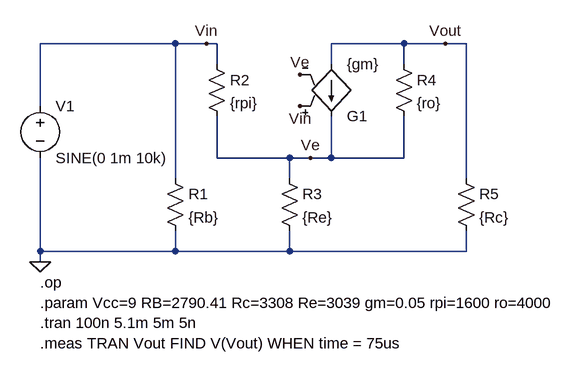
[diagram p0: schematic CE-degen-ro-gain-ac.asc]
CE-degen-ro-gain-ac.asc, the LTspice schematic file:
Version 4
SHEET 1 1048 680
WIRE 192 144 -16 144
WIRE 240 144 192 144
WIRE 256 144 240 144
WIRE 544 144 432 144
WIRE 608 144 544 144
WIRE 640 144 608 144
WIRE 256 176 256 144
WIRE 432 176 432 144
WIRE 544 176 544 144
WIRE -16 240 -16 144
WIRE 256 320 256 256
WIRE 368 320 256 320
WIRE 400 320 368 320
WIRE 432 320 432 256
WIRE 432 320 400 320
WIRE 544 320 544 256
WIRE 544 320 432 320
WIRE 192 352 192 144
WIRE 368 352 368 320
WIRE 640 352 640 144
WIRE -16 464 -16 320
WIRE 192 464 192 432
WIRE 192 464 -16 464
WIRE 368 464 368 432
WIRE 368 464 192 464
WIRE 640 464 640 432
WIRE 640 464 368 464
WIRE -16 480 -16 464
FLAG -16 480 0
FLAG 608 144 Vout
FLAG 400 320 Ve
FLAG 240 144 Vin
FLAG 384 240 Vin
FLAG 384 192 Ve
SYMBOL res 176 336 R0
SYMATTR InstName R1
SYMATTR Value {Rb}
SYMBOL res 240 160 R0
SYMATTR InstName R2
SYMATTR Value {rpi}
SYMBOL res 352 336 R0
SYMATTR InstName R3
SYMATTR Value {Re}
SYMBOL res 528 160 R0
SYMATTR InstName R4
SYMATTR Value {ro}
SYMBOL res 624 336 R0
SYMATTR InstName R5
SYMATTR Value {Rc}
SYMBOL g 432 272 M180
SYMATTR InstName G1
SYMATTR Value {gm}
SYMBOL voltage -16 224 R0
SYMATTR InstName V1
SYMATTR Value SINE(0 1m 10k)
TEXT -16 512 Left 2 !.op\n.param Vcc=9 RB=2790.41 Rc=3308 Re=3039 gm=0.05 rpi=1600 ro=4000\n.tran 100n 5.1m 5m 5n\n.meas TRAN Vout FIND V(Vout) WHEN time = 75us

The netlist it stands for:
* CE-degen-ro-gain-ac.asc
R1 Vin 0 {Rb}
R2 Vin Ve {rpi}
R3 Ve 0 {Re}
R4 Vout Ve {ro}
R5 Vout 0 {Rc}
G1 Vout Ve Vin Ve {gm}
V1 Vin 0 SINE(0 1m 10k)
.op
.param Vcc=9 RB=2790.41 Rc=3308 Re=3039 gm=0.05 rpi=1600 ro=4000
.tran 100n 5.1m 5m 5n
.meas TRAN Vout FIND V(Vout) WHEN time = 75us
.backanno
.end